# EAGLE design EFM8_Tag-Connect (EAGLE 7.4.0)
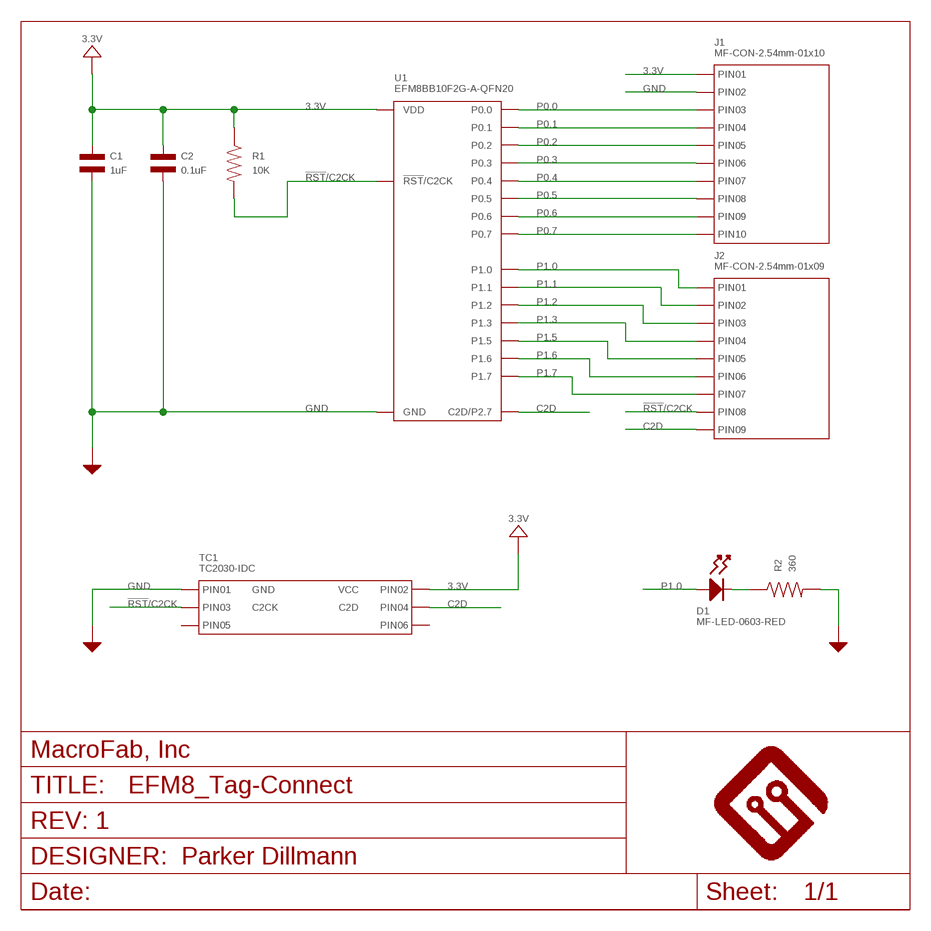
[diagram p0: schematic, sheet 1]

## Parts
C1  1uF  CAPACITOR_NP_0402  [C0402]
C2  0.1uF  CAPACITOR_NP_0402  [C0402]
D1  MF-LED-0603-RED  LED_SINGLE-0603-RED  [LED0603]
FRAME1  MF_FRAMEDEFAULT  [MF_FRAME_DEFAULT]
J1  MF-CON-2.54mm-01x10  CON_01X10_PTH_2.54MM  [PTH_2.54MM_01X10]
J2  MF-CON-2.54mm-01x09  CON_01X09_PTH_2.54MM  [PTH_2.54MM_01X09]
R1  10K  RESISTOR_0402  [R0402]
R2  360  RESISTOR_0402  [R0402]
TC1  TC2030-IDC  CON_02X03_SILABS2TC_TC2030-IDC  [TC2030-IDC-FP]
U1  EFM8BB10F2G-A-QFN20  EFM8BB10F(2/4/8)G-A-QFN20  [EFM8BB10F(2/4/8)G-A-QFN20]

## Nets
3.3V: C1.P$1 C2.P$1 J1.P$1(PIN1) R1.P$1 TC1.P$2(PIN2) U1.P$4(VDD)
!RST!/C2CK: J2.P$8(PIN8) R1.P$2 TC1.P$3(PIN3) U1.P$5(!RST!/C2CK)
C2D: J2.P$9(PIN9) TC1.P$4(PIN4) U1.P$6(C2D/P2.7)
GND: C1.P$2 C2.P$2 J1.P$2(PIN2) R2.P$2 TC1.P$1(PIN1) U1.P$3(GND) U1.P$12(GND) U1.PAD(GND)
N$2: D1.CATHODE R2.P$1
P0.0: J1.P$3(PIN3) U1.P$2(P0.0)
P0.1: J1.P$4(PIN4) U1.P$1(P0.1)
P0.2: J1.P$5(PIN5) U1.P$20(P0.2)
P0.3: J1.P$6(PIN6) U1.P$19(P0.3)
P0.4: J1.P$7(PIN7) U1.P$18(P0.4)
P0.5: J1.P$8(PIN8) U1.P$17(P0.5)
P0.6: J1.P$9(PIN9) U1.P$16(P0.6)
P0.7: J1.P$10(PIN10) U1.P$15(P0.7)
P1.0: D1.ANODE J2.P$1(PIN1) U1.P$14(P1.0)
P1.1: J2.P$2(PIN2) U1.P$13(P1.1)
P1.2: J2.P$3(PIN3) U1.P$11(P1.2)
P1.3: J2.P$4(PIN4) U1.P$10(P1.3)
P1.5: J2.P$5(PIN5) U1.P$8(P1.5)
P1.6: J2.P$6(PIN6) U1.P$7(P1.6)
P1.7: J2.P$7(PIN7) U1.P$9(P1.7)
Unconnected: TC1.P$5(PIN5) TC1.P$6(PIN6)

## Library data of the parts
C1 = MF_Passives:CAPACITOR_NP: Library: MF_Passives Description: Device for Non-Polarized Capacitors. Manufacture part number (MPN) can be added via Attributes. Check https://factory.macrofab.com/parts for the house parts list.; MPN: MF-CAP-0402-1uF; POPULATE: 1
C2 = MF_Passives:CAPACITOR_NP: Library: MF_Passives Description: Device for Non-Polarized Capacitors. Manufacture part number (MPN) can be added via Attributes. Check https://factory.macrofab.com/parts for the house parts list.; MPN: MF-CAP-0402-0.1uF; POPULATE: 1
D1 = MF_LEDs:LED_SINGLE: Library: MF_LEDs Description: Device for Single LED Packages. Manufacture part number (MFG#) can be added via Attributes.; HOUSEPART: YES; MPN: MF-LED-0603-RED; POPULATE: 1; URL: https://factory.macrofab.com/part/MF-LED-0603-RED
FRAME1 = MF_Aesthetics:MF_FRAME: Library: MF_Aesthetics Description: Frame for adding Meta Data to the PCB and Schematic.; DNAME: Parker Dillmann; HOUSEPART: 0; POPULATE: 0; REVNUM: REV: 1
J1 = MF_Connectors:CON_01X10: Library: MF_Connectors Description: Header Connector with 10 Positions and 01 Rows. Use the LABEL Attribute to label the pin on the schematic and PCB. You can remove the attributes on the PCB by using the SMASH function on the part and then deleting the text.; HOUSEPART: YES; MPN: MF-CON-2.54mm-01x10; POPULATE: 1; URL: https://factory.macrofab.com/part/MF-CON-2.54mm-01x10
J2 = MF_Connectors:CON_01X09: Library: MF_Connectors Description: Header Connector with 9 Positions and 01 Rows. Use the LABEL Attribute to label the pin on the schematic and PCB. You can remove the attributes on the PCB by using the SMASH function on the part and then deleting the text.; HOUSEPART: YES; MPN: MF-CON-2.54mm-01x09; POPULATE: 1; URL: https://factory.macrofab.com/part/MF-CON-2.54mm-01x09
R1 = MF_Passives:RESISTOR: Library: MF_Passives Description: Device for Resistors. Manufacture part number (MPN), Voltage, Tolerance, and Wattage Rating can be added via Attributes. Check https://factory.macrofab.com/parts for the house parts list.; MPN: MF-RES-0402-10K; POPULATE: 1
R2 = MF_Passives:RESISTOR: Library: MF_Passives Description: Device for Resistors. Manufacture part number (MPN), Voltage, Tolerance, and Wattage Rating can be added via Attributes. Check https://factory.macrofab.com/parts for the house parts list.; MPN: MF-RES-0402-360; POPULATE: 1
TC1 = MF_Connectors:CON_02X03: Library: MF_Connectors Description: Header Connector with 6 Positions and 02 Rows. Use the LABEL Attribute to label the pin on the schematic and PCB. You can remove the attributes on the PCB by using the SMASH function on the part and then deleting the text.; HOUSEPART: NO; LABEL01: GND; LABEL02: VCC; LABEL03: C2CK; LABEL04: C2D; MPN: TC2030-IDC; POPULATE: 0; URL: http://www.tag-connect.com/TC2030-IDC
U1 = MF_IC_Digital:EFM8BB10F(2/4/8)G-A-QFN20: Manufacturer Part #: EFM8BB10F(2/4/8)G-A-QFN20 Manufacturer: Silicon Labs Description: Busy Bee 8-bit Microcontrollers - MCU (2/4/8)kB / (256/512)B RAM 12b ADC; HOUSEPART: NO; MPN: EFM8BB10F2G-A-QFN20; POPULATE: 1; URL: http://www.silabs.com/products/mcu/8-bit/efm8-busy-bee/Pages/efm8-busy-bee.aspx

## Board
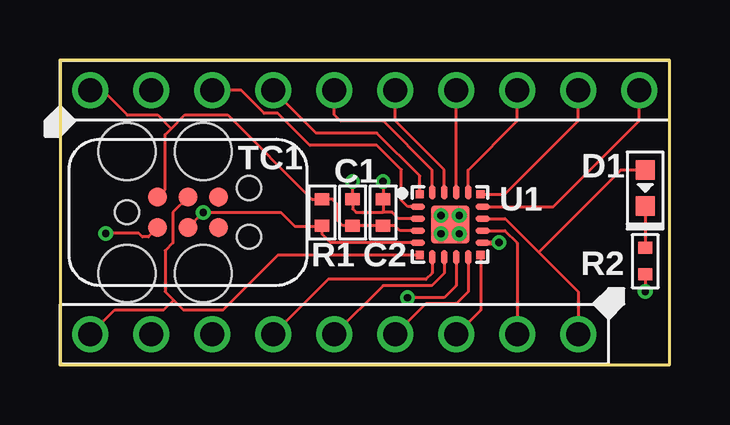
[diagram p1: board, top side]
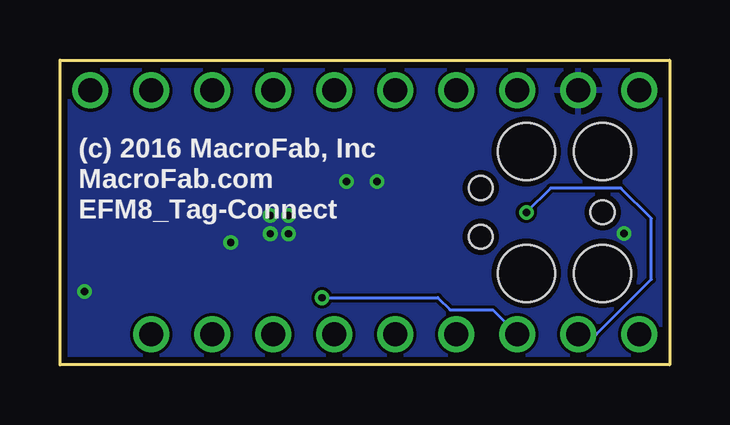
[diagram p2: board, bottom side, seen from below]

Size 25.4 x 12.7 mm. Coordinates in mm from the lower left corner, seen from the top.
Outline: 0,0 25.4,0 25.4,12.7 0,12.7 0,0
Copper layers (1*16): Top 0.035mm / dielectric 1.5mm / Bottom 0.035mm
Design rules "MF_Standard_2_Layer": minimum track width 5mil, minimum drill 12mil, track to track 5mil, track to pad 5mil, pad to pad 5mil, via to via 5mil, smd to smd 0mil, copper to edge 10mil, drill to drill 10mil, minimum pad ring 6mil, minimum via ring 6mil, stop-mask expansion 2mil, vias tented up to drill 25mil, thermal gap 10mil

### Footprints (pad centres in the part's own frame; a part is rotated, then mirrored left to right if it is on the bottom)
C0402 = smd 0.5 x 0.6: P$1 -0.55,0; P$2 0.55,0
LED0603 = smd 0.8 x 0.8: ANODE 0.75,0; CATHODE -0.75,0
PTH_2.54MM_01X10 = drill 1: P$1 -11.43,0; P$2 -8.89,0; P$3 -6.35,0; P$4 -3.81,0; P$5 -1.27,0; P$6 1.27,0; P$7 3.81,0; P$8 6.35,0; P$9 8.89,0; P$10 11.43,0
PTH_2.54MM_01X09 = drill 1: P$1 -10.16,0; P$2 -7.62,0; P$3 -5.08,0; P$4 -2.54,0; P$5 0,0; P$6 2.54,0; P$7 5.08,0; P$8 7.62,0; P$9 10.16,0
R0402 = smd 0.5 x 0.6: P$1 -0.55,0; P$2 0.55,0
TC2030-IDC-FP = smd 0.787 x 0.787: P$1 -1.27,-0.635; P$2 -1.27,0.635; P$3 0,-0.635; P$4 0,0.635; P$5 1.27,-0.635; P$6 1.27,0.635 | hole 0.991: 2.54,1.016; 2.54,-1.016; -2.54,0 | hole 2.375: -2.54,2.54; 0.635,2.54; 0.635,-2.54; -2.54,-2.54
EFM8BB10F(2/4/8)G-A-QFN20 = smd 0.34 x 0.34: P$1 -1.265,1.265; P$6 -1.265,-1.265; P$11 1.265,-1.265; P$16 1.265,1.265 | smd 0.61 x 0.28: P$2 -1.355,0.75; P$3 -1.355,0.25; P$4 -1.355,-0.25; P$5 -1.355,-0.75; P$12 1.355,-0.75; P$13 1.355,-0.25; P$14 1.355,0.25; P$15 1.355,0.75 | smd 0.28 x 0.61: P$7 -0.75,-1.355; P$8 -0.25,-1.355; P$9 0.25,-1.355; P$10 0.75,-1.355; P$17 0.75,1.355; P$18 0.25,1.355; P$19 -0.25,1.355; P$20 -0.75,1.355 | smd 1.6 x 1.6: PAD 0,0

### Placement (x,y rotation side)
C1  12.19,6.35 90 top
C2  13.46,6.35 90 top
D1  24.38,7.37 90 top
FRAME1  24.64,9.91 0 bottom
J1  12.7,11.43 0 top
J2  11.43,1.27 180 top
R1  10.92,6.35 270 top
R2  24.38,4.32 270 top
TC1  5.33,6.35 0 top
U1  16.26,5.84 0 top

### Tracks (layer width: path | path; a pad name or v marks a point on that pad's centre or on a via)
3.3V
  Top 0.127: U1.P$4 14.16,5.59 13.95,5.8 C2.P$1 C1.P$1 11.79,5.8 11.56,6.03 11.56,6.69 11.35,6.9 R1.P$1 10.5,6.9 6.99,10.41 5.21,10.41 4.64,9.84 | TC1.P$2 4.38,7.3 4.38,9.59 4.64,9.84 | J1.P$1 1.78,11.43 2.79,10.41 4.06,10.41 4.64,9.84
!RST!/C2CK  (via drill 0.3)
  Top 0.127: U1.P$5 11.27,5.09 10.92,5.44 R1.P$2 11.15,5.78 9.78,5.78 9.21,6.35 6.35,6.35 v5.97,6.35 TC1.P$3
  Bottom 0.127: J2.P$8 3.05,1.27 0.76,3.56 0.76,6.1 2.03,7.37 4.95,7.37 v5.97,6.35
C2D
  Top 0.127: U1.P$6 9.09,4.58 6.79,2.29 5.14,2.29 4.73,2.7 | TC1.P$4 4.7,6.35 4.7,5.08 4.38,4.76 4.38,3.05 4.73,2.7 | J2.P$9 2.29,2.29 4.32,2.29 4.73,2.7
GND  (via drill 0.3)
  Top 0.127: U1.P$3 14.1,6.09 13.84,6.35 13.46,6.35 | 13.46,6.35 12.33,6.35 12.19,6.49 C1.P$2 v12.19,7.63 | 13.46,6.35 C2.P$2 v13.46,7.63 | R2.P$2 v24.38,3.05 | v15.88,5.46 U1.PAD | TC1.P$1 3.68,5.33 3.43,5.33 3.29,5.47 v1.91,5.47
  Top 0.203: U1.P$12 v18.29,5.09
  other vias: 15.88,6.22 16.64,6.22 16.64,5.46
  pour Bottom: 0,12.7 25.4,12.7 25.4,0 0,0
N$2
  Top 0.127: D1.CATHODE R2.P$1
P0.0
  Top 0.127: U1.P$2 14.49,6.59 14.22,6.86 14.22,8.13 13.21,9.14 10.41,9.14 9.08,10.48 8.51,10.48 7.56,11.43 J1.P$3
P0.1
  Top 0.127: U1.P$1 14.99,7.87 13.21,9.65 10.67,9.65 J1.P$4
P0.2
  Top 0.127: U1.P$20 15.51,8.12 13.46,10.16 11.68,10.16 11.43,10.41 J1.P$5
P0.3
  Top 0.127: U1.P$19 16.01,8.12 13.97,10.16 J1.P$6
P0.4
  Top 0.127: U1.P$18 J1.P$7
P0.5
  Top 0.127: U1.P$17 17.01,8.12 19.05,10.16 J1.P$8
P0.6
  Top 0.127: U1.P$16 18.54,7.11 21.59,10.16 J1.P$9
P0.7
  Top 0.127: U1.P$15 20.56,6.59 24.13,10.16 J1.P$10
P1.0
  Top 0.127: U1.P$14 18.55,6.09 19.94,4.7 | 19.94,4.7 21.59,3.05 J2.P$1 | D1.ANODE 23.36,8.12 19.94,4.7
P1.1
  Top 0.127: U1.P$13 18.54,5.59 19.05,5.08 J2.P$2
P1.2
  Top 0.127: U1.P$11 17.52,2.28 J2.P$3
P1.3
  Top 0.127: U1.P$10 17.01,3.04 16.51,2.54 15.24,2.54 J2.P$4
P1.5
  Top 0.127: U1.P$8 16.01,3.81 15.49,3.3 13.46,3.3 J2.P$5
P1.6
  Top 0.127: U1.P$7 15.51,3.82 15.24,3.56 11.18,3.56 J2.P$6
P1.7  (via drill 0.3)
  Top 0.127: U1.P$9 16.51,3.3 16,2.79 v14.48,2.79
  Bottom 0.127: v14.48,2.79 9.65,2.79 9.14,2.29 7.37,2.29 J2.P$7